# EAGLE schematic rf433schield (EAGLE 6.3)
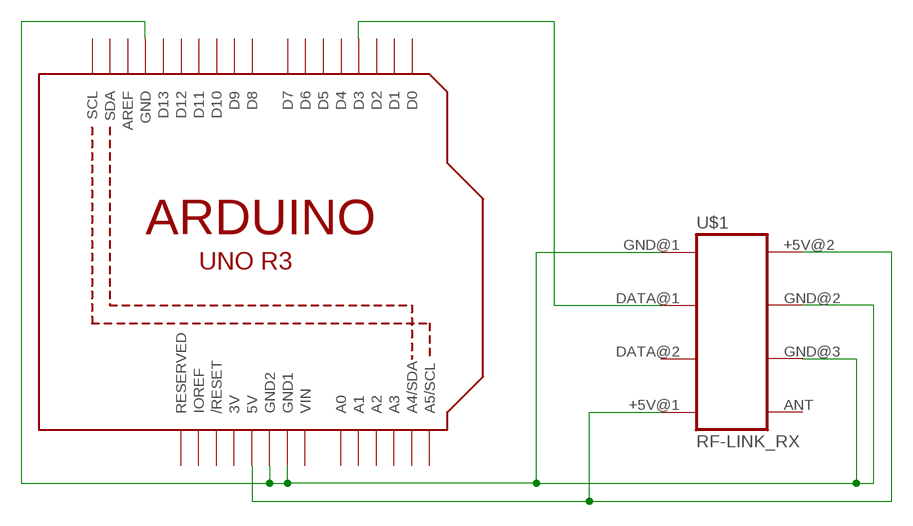
[diagram p0: schematic, sheet 1]

## Parts
U1  ARDUINOR3-DIMENSION  [ARDUINOR3]
U$1  RF-LINK_RX  [RF-LINK_RX]

## Nets
GND: U1.GND U1.GND1 U1.GND2 U$1.GND@1(GND1) U$1.GND@2(GND2) U$1.GND@3(GND3)
N$1: U1.D3 U$1.DATA@1(DATA_OUT)
VCC: U1.5V U$1.+5V@1(VCC1) U$1.+5V@2(VCC2)
Unconnected: U1.A0 U1.A1 U1.A2 U1.A3 U1.A4(A4/SDA) U1.A5(A5/SCL) U1.AREF U1.D0 U1.D1 U1.D2 U1.D4 U1.D5 U1.D6 U1.D7 U1.D8 U1.D9 U1.D10 U1.D11 U1.D12 U1.D13 U1.IOREF U1.RESERVED U1.RESET(/RESET) U1.SCL U1.SDA U$1.ANT U$1.DATA@2(LINEAR_OUT)

## Power pins joined to a net without a drawn wire
3V: U1.3V
VIN: U1.VIN

## Library data of the parts
U1 = RFM:ARDUINOR3: This is a new object for the new Arduino R3 - with extra pins that you may want to use (such as IOref, and duplicated A4/A5
U$1 = RFM:RF-LINK_RX: RF Link receivers- WRL-8947, 8948, 8949, 8950